# Altium project PCB_Shield_v3.PrjPcb
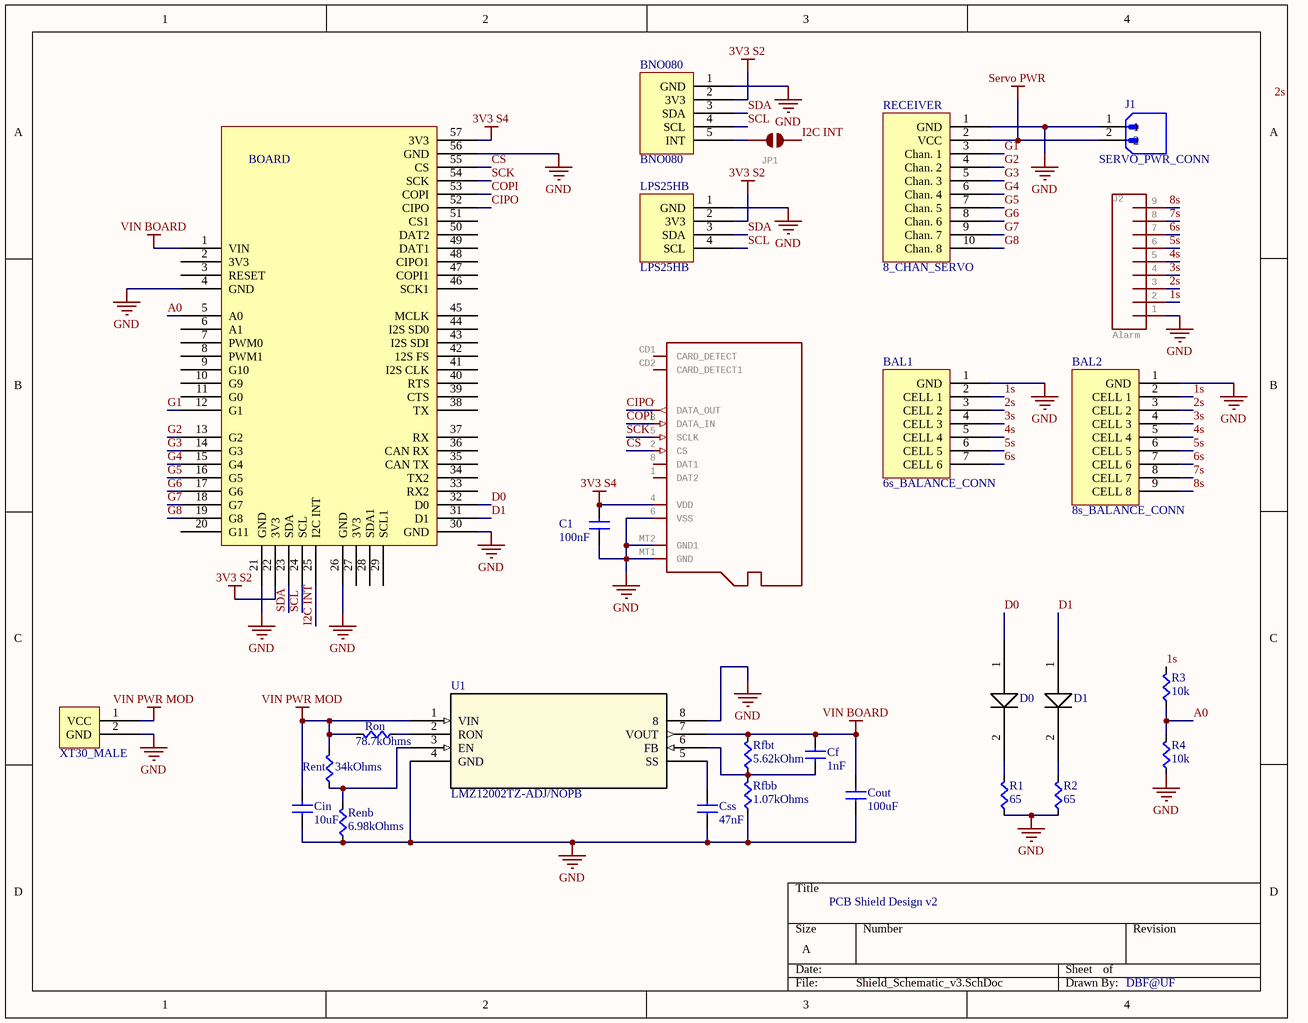
[diagram p0: Shield_Schematic_v3.SchDoc]
1 sheet, 28 parts. Net scope: global (net labels, ports and power ports of the same name join across sheets).
Board file: PCB-Shield_v3.PcbDoc

## Sheet Shield_Schematic_v3.SchDoc
size A; SheetNumber: 1; SheetTotal: 1

### Parts
BAL1  6s_BALANCE_CONN  [B7B-XH-A]
BAL2  8s_BALANCE_CONN  [B9B-XH-A]
BNO080  BNO080  [BNO080]
BOARD  SHIELD  [Shield]  (value not drawn)
C1  value 100nF  [CAPC 0603]  (hidden comment: Cap (0603))
Cf  value 1nF  [CAPC 0402]  (hidden comment: Cap (0402))
Cin  value 10uF  [CAPC 0805]  (hidden comment: Cap (0805))
Cout  value 100uF  [CAPC 1206]  (hidden comment: Cap (1206))
Css  value 47nF  [CAPC 0805]  (hidden comment: Cap (0805))
D0  LED (0805)  [LED 0805]  (value not drawn)
D1  LED (0805)  [LED 0805]  (value not drawn)
J1  SERVO_PWR_CONN  [1053091102]
J2  Alarm  [1X09_NO_SILK]
JP1  Normally open jumper    This jumper has two pads in close proximity to each other. Apply solder to close the connection.   Round pads are easier to solder for beginners, but are a lot larger.   SparkFun Product that uses the round pads:  SparkFun EL Sequencer  [SMT-JUMPER_2_NO_SILK]  (value not drawn)
LPS25HB  LPS25HB  [LPS25HB]
R1  value 65  [RES 0603]  (hidden comment: Res (0603))
R2  value 65  [RES 0603]  (hidden comment: Res (0603))
R3  value 10k  [RES 0603]  (hidden comment: Res (0603))
R4  value 10k  [RES 0603]  (hidden comment: Res (0603))
RECEIVER  8_CHAN_SERVO  [8_CHAN_SERVO]
Renb  value 6.98kOhms  [RES 0805]  (hidden comment: Res (0805))
Rent  value 34kOhms  [RES 0805]  (hidden comment: Res (0805))
Rfbb  value 1.07kOhms  [RES 0805]  (hidden comment: Res (0805))
Rfbt  value 5.62kOhm  [RES 0805]  (hidden comment: Res (0805))
Ron  value 78.7kOhms  [RES 0805]  (hidden comment: Res (0805))
U1  LMZ12002TZ-ADJ/NOPB  [LMZ12002]
uSD  Micro-SD / Transflash card holder with SPI pinout   For the 3M # 2908-05WB-MG and/or 4UCON #19656 push-push type  [MICROSD]  (value not drawn)
XT30  XT30_MALE  [XT30_MALE]

### Nets
3V3 S2: BNO080.2(3V3) BOARD.22(3V3) LPS25HB.2(3V3)
3V3 S4: BOARD.57(3V3) C1.1(A) uSD.4(VDD)
GND: BAL1.1(GND) BAL2.1(GND) BNO080.1(GND) BOARD.4(GND) BOARD.21(GND) BOARD.26(GND) BOARD.30(GND) BOARD.56(GND) C1.2(B) Cin.2(B) Cout.2(B) Css.2(B) J1.1 J2.1 LPS25HB.1(GND) R1.2(B) R2.2(B) R4.2(B) RECEIVER.1(GND) Renb.2(B) Rfbb.2(B) U1.4(GND) U1.8 uSD.6(VSS) uSD.MT1(GND) uSD.MT2(GND1) XT30.2(GND)
Servo PWR: J1.2 RECEIVER.2(VCC)
VIN BOARD: BOARD.1(VIN) Cf.1(A) Cout.1(A) Rfbt.1(A) U1.7(VOUT)
VIN PWR MOD: Cin.1(A) Rent.1(A) Ron.1(A) U1.1(VIN) XT30.1(VCC)
1s: BAL1.2(CELL_1) BAL2.2(CELL_1) J2.2 R3.1(A)
2s: BAL1.3(CELL_2) BAL2.3(CELL_2) J2.3
3s: BAL1.4(CELL_3) BAL2.4(CELL_3) J2.4
4s: BAL1.5(CELL_4) BAL2.5(CELL_4) J2.5
5s: BAL1.6(CELL_5) BAL2.6(CELL_5) J2.6
6s: BAL1.7(CELL_6) BAL2.7(CELL_6) J2.7
7s: BAL2.8(CELL_7) J2.8
8s: BAL2.9(CELL_8) J2.9
A0: BOARD.5(A0) R3.2(B) R4.1(A)
CIPO: BOARD.52(CIPO) uSD.7(DATA_OUT)
COPI: BOARD.53(COPI) uSD.3(DATA_IN)
CS: BOARD.55(CS) uSD.2(CS)
D0: BOARD.32(D0) D0.1(+)
D1: BOARD.31(D1) D1.1(+)
G1: BOARD.12(G1) RECEIVER.3(Chan._1)
G2: BOARD.13(G2) RECEIVER.4(Chan._2)
G3: BOARD.14(G3) RECEIVER.5(Chan._3)
G4: BOARD.15(G4) RECEIVER.6(Chan._4)
G5: BOARD.16(G5) RECEIVER.7(Chan._5)
G6: BOARD.17(G6) RECEIVER.8(Chan._6)
G7: BOARD.18(G7) RECEIVER.9(Chan._7)
G8: BOARD.19(G8) RECEIVER.10(Chan._8)
I2C INT: BOARD.25(I2C_INT) JP1.2
SCK: BOARD.54(SCK) uSD.5(SCLK)
SCL: BNO080.4(SCL) BOARD.24(SCL) LPS25HB.4(SCL)
SDA: BNO080.3(SDA) BOARD.23(SDA) LPS25HB.3(SDA)
NetBNO080_5: BNO080.5(INT) JP1.1
NetCf_2: Cf.2(B) Rfbb.1(A) Rfbt.2(B) U1.6(FB)
NetCss_1: Css.1(A) U1.5(SS)
NetD0_2: D0.2(-) R1.1(A)
NetD1_2: D1.2(-) R2.1(A)
NetRenb_1: Renb.1(A) Rent.2(B) U1.3(EN)
NetRon_2: Ron.2(B) U1.2(RON)

Not connected (* = marked no-connect by the designer): BOARD 2(3V3) 3(RESET) 6(A1) 7(PWM0) 8(PWM1) 9(G10) 10(G9) 11(G0) 20(G11) 27(3V3) 28(SDA1) 29(SCL1) 33(RX2) 34(TX2) 35(CAN_TX) 36(CAN_RX) 37(RX) 38(TX) 39(CTS) 40(RTS) 41(I2S_CLK) 42(12S_FS) 43(I2S_SDI) 44(I2S_SD0) 45(MCLK) 46(SCK1) 47(COPI1) 48(CIPO1) 49(DAT1) 50(DAT2) 51(CS1); uSD 1(DAT2) 8(DAT1) CD1(CARD_DETECT) CD2(CARD_DETECT1)

### Notes on the sheet
- PCB Shield Design v2
- DBF@UF
- Labels drawn without touching a wire or pin: 2s

### Library data of the parts
BNO080 = BNO080: BNO080 Breakout Board
J1 = SERVO_PWR_CONN: Connector Header Through Hole 2 position 0.098 (2.50mm); MF: Molex; Package: None; Check_prices: https://www.snapeda.com/parts/1053091102/Molex/view-part/2711154/?ref=eda; Value: *; Price: None; Availability: Not in stock; MP: 1053091102; SnapEDA_Link: https://www.snapeda.com/parts/1053091102/Molex/view-part/2711154/?ref=snap
J2 = CONN_09NO_SILK_FEMALE_PTH: GateName_1: G$1; SymbolName_1: CONN_08; PROD_ID: CONN-08438; DeviceName: NO_SILK_FEMALE_PTH; LibraryName: SparkFun-Connectors; DeviceSetName: CONN_08; Package: 1X08_NO_SILK
JP1 = JUMPER-SMT_2_NO_SILK: GateName_1: G$1; SymbolName_1: SMT-JUMPER_2_NO; DeviceName: _SILK; LibraryName: SparkFun-Jumpers; DeviceSetName: JUMPER-SMT_2_NO; Package: SMT-JUMPER_2_NO_SILK
LPS25HB = LPS25HB: LPS25HB Breakout Board
U1 = LMZ12002TZ-ADJ/NOPB: 2A SIMPLE SWITCHER® Power Module with 20V Maximum Input Voltage; Manufacturer: Texas Instruments; NSC_PackageReference: TZA07A; DatasheetURL: http://www.ti.com/lit/ds/symlink/lmz12002.pdf; basePN: LMZ12002; Manufacturer_Part_Number: LMZ12002TZ-ADJ/NOPB; Vendor: Texas Instruments; Copyright: Copyright (C) 2018 Accelerated Designs. All rights reserved; RefDes: RefDes; Type: DEV
uSD = MICROSD: GateName_1: G$1; SymbolName_1: TRANSFLASH; LibraryName: adafruit; DeviceSetName: MICROSD; Package: MICROSD
C1 = Cap (0603): Supplier 1: Digi-Key; Supplier Part Number 1: 1276-1000-1-ND
Cf = Cap (0402): Supplier 1: RSComponents; Supplier 2: Digi-Key; Supplier Part Number 1: 8145808P; Supplier Part Number 2: 490-10702-1-ND
Cin Css = Cap (0805): Supplier 1: Digi-Key; Supplier Part Number 1: 490-10748-1-ND
Cout = Cap (1206): Supplier 1: Digi-Key; Supplier Part Number 1: 445-6007-1-ND
R1-R4 = Res (0603): Supplier 1: Digi-Key; Supplier Part Number 1: RMCF0603JT10K0CT-ND
Renb Rent Rfbb Rfbt Ron = Res (0805): Supplier 1: Digi-Key; Supplier 2: Digi-Key; Supplier 3: Digi-Key; Supplier 4: Digi-Key; Supplier 5: Digi-Key; Supplier Part Number 1: P6.98KCCT-ND; Supplier Part Number 2: P1.07KCCT-ND; Supplier Part Number 3: P5.62KCCT-ND; Supplier Part Number 4: P34.0KCCT-ND; Supplier Part Number 5: P78.7KCCT-ND